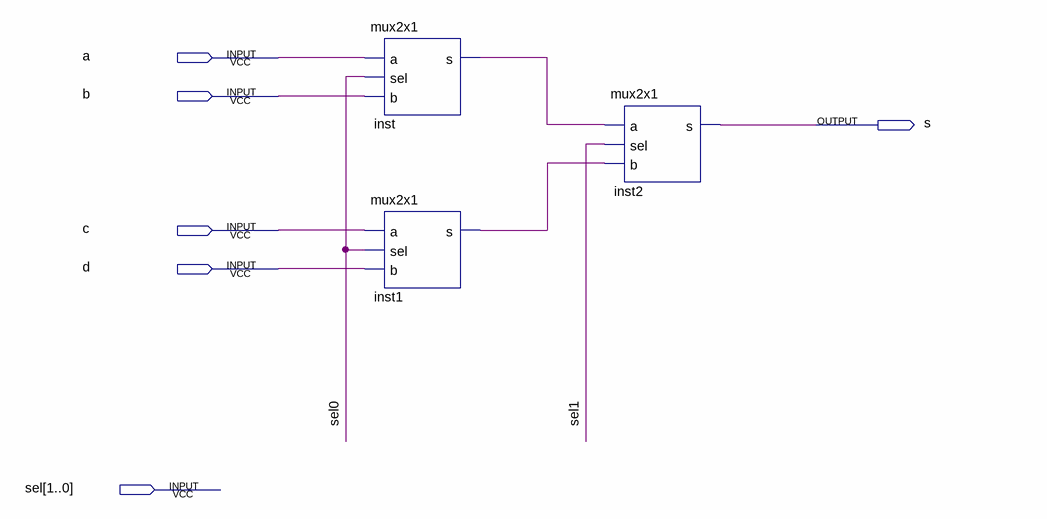
[diagram p0: schematic sheet]
// Quartus schematic mux4x1.bdf as structural Verilog: 3 symbols, 6 pins
module mux4x1 (
  input  a,
  input  b,
  input  c,
  input  d,
  input  [1:0] sel,
  output s
);

  wire inst1_s, inst_s;

  mux2x1 inst (.a(a), .sel(sel[0]), .b(b), .s(inst_s));
  mux2x1 inst1 (.a(c), .sel(sel[0]), .b(d), .s(inst1_s));
  mux2x1 inst2 (.a(inst_s), .sel(sel[1]), .b(inst1_s), .s(s));
endmodule
